# Altium schematic sheet Motor_TB6612.SchDoc
size A4
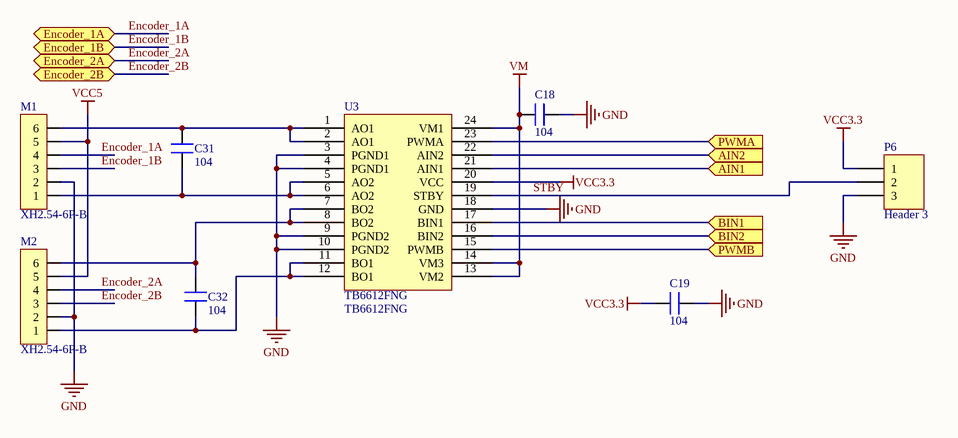
[diagram p0: Motor_TB6612.SchDoc]

## Parts
C18  104  [0603C]
C19  104  [0603C]
C31  104  [0603C]
C32  104  [0603C]
M1  XH2.54-6P-B  [XH2.54-6P-A]
M2  XH2.54-6P-B  [XH2.54-6P-A]
P6  Header 3  [HDR1X3]
U3  TB6612FNG  [SSOP24-300-0.65D]

## Ports
AIN1 (in), AIN2 (in), BIN1 (in), BIN2 (in), Encoder_1A, Encoder_1B, Encoder_2A, Encoder_2B, PWMA (in), PWMB (in)

## Nets
GND: C18.2 C19.2 M1.2 M2.2 P6.3 U3.3(PGND1) U3.4(PGND1) U3.9(PGND2) U3.10(PGND2) U3.18(GND)
VCC3.3: C19.1 P6.1 U3.20(VCC)
VCC5: M1.5 M2.5
VM: C18.1 U3.13(VM2) U3.14(VM3) U3.24(VM1)
AIN1: U3.21(AIN1) ; port AIN1
AIN2: U3.22(AIN2) ; port AIN2
BIN1: U3.17(BIN1) ; port BIN1
BIN2: U3.16(BIN2) ; port BIN2
Encoder_1A: M1.4 ; port Encoder_1A
Encoder_1B: M1.3 ; port Encoder_1B
Encoder_2A: M2.4 ; port Encoder_2A
Encoder_2B: M2.3 ; port Encoder_2B
PWMA: U3.23(PWMA) ; port PWMA
PWMB: U3.15(PWMB) ; port PWMB
STBY: P6.2 U3.19(STBY)
NetC31_1: C31.1 M1.1 U3.5(AO2) U3.6(AO2)
NetC31_2: C31.2 M1.6 U3.1(AO1) U3.2(AO1)
NetC32_1: C32.1 M2.1 U3.11(BO1) U3.12(BO1)
NetC32_2: C32.2 M2.6 U3.7(BO2) U3.8(BO2)

## Library data of the parts
C18 C19 C31 C32 = C
P6 = Header 3: Header, 3-Pin; LatestRevisionDate: 17-Jul-2002; LatestRevisionNote: Re-released for DXP Platform.; Publisher: Altium Limited